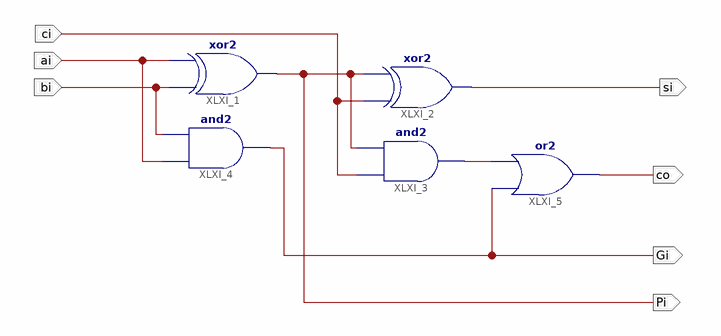
[diagram p0: schematic sheet 1]
// Xilinx ISE schematic add.sch (spartan3) as structural Verilog: 5 symbols, 7 ports
module add (
  input  ci,
  input  bi,
  input  ai,
  output Gi,
  output si,
  output co,
  output Pi
);

  wire XLXN_10;

  xor XLXI_2 (si, ci, Pi);
  and XLXI_3 (XLXN_10, ci, Pi);
  xor XLXI_1 (Pi, bi, ai);
  and XLXI_4 (Gi, ai, bi);
  or XLXI_5 (co, Gi, XLXN_10);
endmodule
